# EAGLE schematic MODULO GPS (EAGLE 9.6.2)
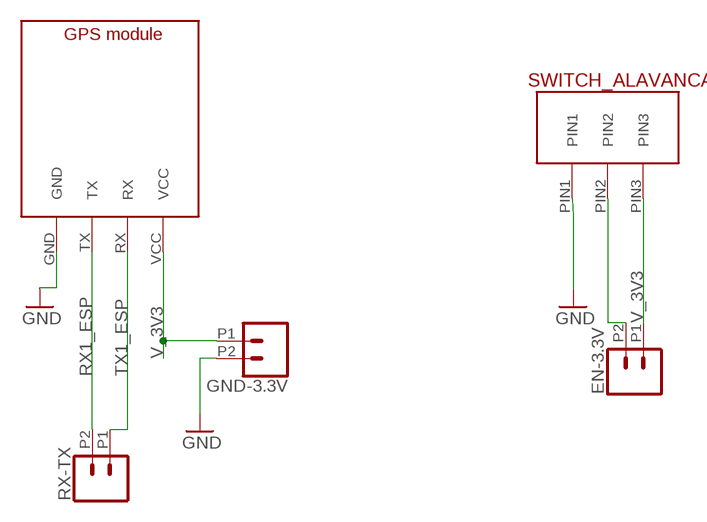
[diagram p0: schematic, sheet 1]

## Parts
EN-3.3V  CONN_022.54MM_SCREWTERM  [1X02_2.54_SCREWTERM]
GND-3.3V  CONN_022.54MM_SCREWTERM  [1X02_2.54_SCREWTERM]
RX-TX  CONN_022.54MM_SCREWTERM  [1X02_2.54_SCREWTERM]
U$1  SWITCH_ALAVANCA  [SWITCH_ALAVANCA_FOOTPRINT]
U$3  GPS_MODULE  [GPS_MODULE_FOOTPRINT]

## Nets
ENABLE_SIGNAL: EN-3.3V.P2 U$1.PIN2
GND: GND-3.3V.P2 U$1.PIN1 U$3.GND
RX1_ESP: RX-TX.P2 U$3.TX
TX1_ESP: RX-TX.P1 U$3.RX
V_3V3: EN-3.3V.P1 GND-3.3V.P1 U$1.PIN3 U$3.VCC

## Library data of the parts
EN-3.3V GND-3.3V RX-TX = SparkFun-Connectors:CONN_02: Multi connection point. Often used as Generic Header-pin footprint for 0.1 inch spaced/style header connections On any of the 0.1 inch spaced packages, you can populate with these: Break Away Headers - Straight <https://www.sparkfun.com/products/116> (PRT-00116) Break Away Male Headers - Right Angle <https://www.sparkfun.com/products/553> (PRT-00553) Female Headers <https://www.sparkfun.com/products/115> (PRT-00115) Break Away Headers - Machine Pin <https://www.sparkfun.com/products/117> (PRT-00117) Break Away Female Headers - Swiss Machine Pin <https://www.sparkfun.com/products/743> (PRT-00743) For SCREWTERMINALS and SPRING TERMINALS visit here: Screw Terimnals on SparkFun.com <https://www.sparkfun.com/search/results?term=Screw+Terminals> (5mm/3.5mm/2.54mm spacing) This device is also useful as a general connection point to wire up your design to another part of your project. Our various solder wires solder well into these plated through hole pads. Hook-Up Wire - Assortment (Stranded, 22 AWG) <https://www.sparkfun.com/products/11375> (PRT-11375) Hook-Up Wire - Assortment (Solid Core, 22 AWG) <https://www.sparkfun.com/products/11367> (PRT-11367) View the entire wire category on our website here <https://www.sparkfun.com/categories/141> Special notes: Molex polarized connector foot print use with: PRT-08233 with associated crimp pins and housings. 2.54_SCREWTERM for use with PRT-10571. 3.5mm Screw Terminal footprints for PRT-08084 5mm Screw Terminal footprints for use with PRT-08432
U$1 = CRD:SWITCH_ALAVANCA
U$3 = CRD:GPS_MODULE